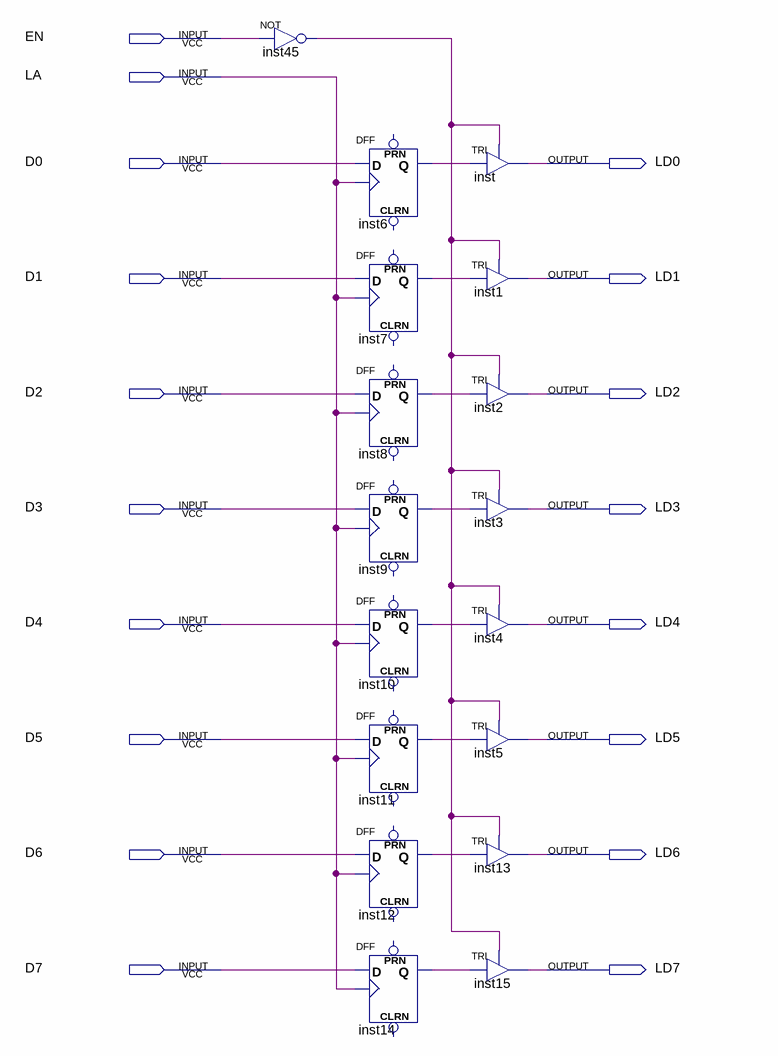
[diagram p0: schematic sheet]
// Quartus schematic 8latchedgeb.bdf as structural Verilog: 17 symbols, 18 pins
module \8latchedgeb  (
  input  EN,
  input  LA,
  input  D0,
  input  D1,
  input  D2,
  input  D3,
  input  D4,
  input  D5,
  input  D6,
  input  D7,
  output LD0,
  output LD1,
  output LD2,
  output LD3,
  output LD4,
  output LD5,
  output LD6,
  output LD7
);

  wire inst6_q, inst7_q, inst8_q, inst9_q, inst10_q, inst11_q, inst12_q, inst14_q, inst45_out;

  not inst45 (inst45_out, EN);
  DFF inst6 (.CLK(LA), .D(D0), .Q(inst6_q));  // open: CLRN, PRN
  DFF inst7 (.CLK(LA), .D(D1), .Q(inst7_q));  // open: CLRN, PRN
  DFF inst8 (.CLK(LA), .D(D2), .Q(inst8_q));  // open: CLRN, PRN
  DFF inst9 (.CLK(LA), .D(D3), .Q(inst9_q));  // open: CLRN, PRN
  DFF inst10 (.CLK(LA), .D(D4), .Q(inst10_q));  // open: CLRN, PRN
  DFF inst11 (.CLK(LA), .D(D5), .Q(inst11_q));  // open: CLRN, PRN
  DFF inst12 (.CLK(LA), .D(D6), .Q(inst12_q));  // open: CLRN, PRN
  DFF inst14 (.CLK(LA), .D(D7), .Q(inst14_q));  // open: CLRN, PRN
  TRI inst (.IN(inst6_q), .OE(inst45_out), .OUT(LD0));
  TRI inst1 (.IN(inst7_q), .OE(inst45_out), .OUT(LD1));
  TRI inst2 (.IN(inst8_q), .OE(inst45_out), .OUT(LD2));
  TRI inst3 (.IN(inst9_q), .OE(inst45_out), .OUT(LD3));
  TRI inst4 (.IN(inst10_q), .OE(inst45_out), .OUT(LD4));
  TRI inst5 (.IN(inst11_q), .OE(inst45_out), .OUT(LD5));
  TRI inst13 (.IN(inst12_q), .OE(inst45_out), .OUT(LD6));
  TRI inst15 (.IN(inst14_q), .OE(inst45_out), .OUT(LD7));
endmodule
